# EAGLE design P_B_Jan_2018 (EAGLE 7.1.0)
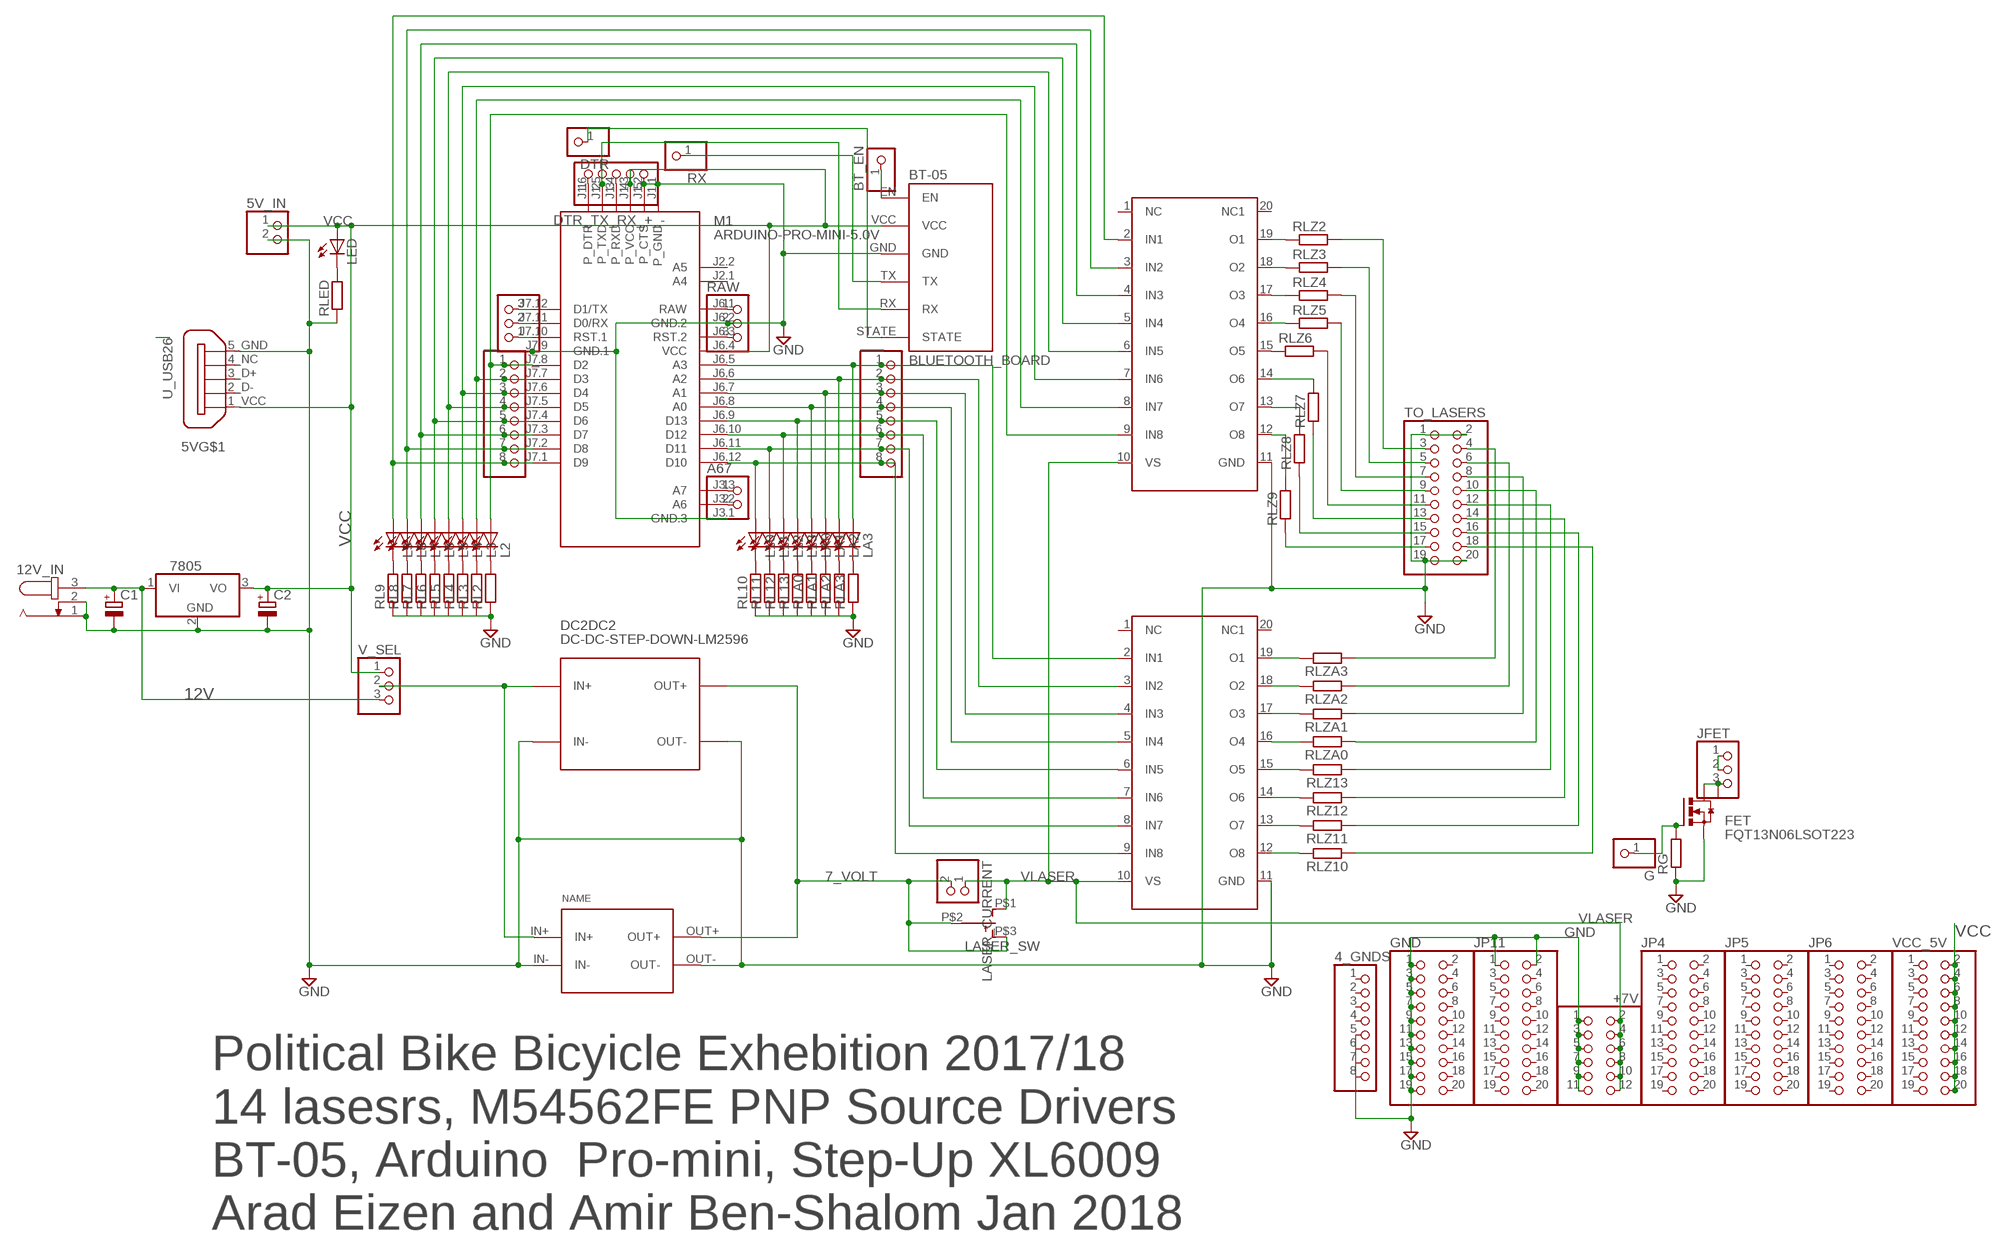
[diagram p0: schematic, sheet 1]

## Parts
4_GNDS  PINHD-1X8  [1X08]
5V  U_USB26  [U_USB_26]
5V_IN  PINHD-1X2SQ&RND  [1X02_SQ&ROUND]
12V_IN  JACK-PLUGHOLE_PAD  [JACK_DC]
7805  7805TV  [TO220V]
+7V  PINHD-2X6  [2X06]
_  PINHD-1X3  [1X03]
__  PINHD-1X8  [1X08]
___  PINHD-1X8  [1X08]
A67  PINHD-1X2ROUND_PAD  [1X02_ROUND_PAD]
BT-05  BLUETOOTH_BOARD  [BT_BOARD_FOOTPRINT]
BT_EN  PINHD-1X1  [1X01]
C1  CPOL-EUE3.5-10  [E3,5-10]
C2  CPOL-EUE2.5-6  [E2,5-6]
DC2DC  DC2DC_CP8-ADJ  [CP8-ADJ]
DC2DC2  DC-DC-STEP-DOWN-LM2596  [DC-DC-STEP-DOWN-LM2596]
DTR  PINHD-1X1  [1X01]
DTR_TX_RX_+_-  PINHD-1X5  [1X05]
FET  FQT13N06LSOT223  [SOT223]
G  PINHD-1X1  [1X01]
GND  PINHD-2X10  [2X10]
JFET  PIN_HEAD_1X3_MARKED2.56  [1X3_MARKED]
JP4  PINHD-2X10  [2X10]
JP5  PINHD-2X10  [2X10]
JP6  PINHD-2X10  [2X10]
JP11  PINHD-2X10  [2X10]
L2  LEDCHIPLED_1206  [CHIPLED_1206]
L3  LEDCHIPLED_1206  [CHIPLED_1206]
L4  LEDCHIPLED_1206  [CHIPLED_1206]
L5  LEDCHIPLED_1206  [CHIPLED_1206]
L6  LEDCHIPLED_1206  [CHIPLED_1206]
L7  LEDCHIPLED_1206  [CHIPLED_1206]
L8  LEDCHIPLED_1206  [CHIPLED_1206]
L9  LEDCHIPLED_1206  [CHIPLED_1206]
L10  LEDCHIPLED_1206  [CHIPLED_1206]
L11  LEDCHIPLED_1206  [CHIPLED_1206]
L12  LEDCHIPLED_1206  [CHIPLED_1206]
L13  LEDCHIPLED_1206  [CHIPLED_1206]
LA0  LEDCHIPLED_1206  [CHIPLED_1206]
LA1  LEDCHIPLED_1206  [CHIPLED_1206]
LA2  LEDCHIPLED_1206  [CHIPLED_1206]
LA3  LEDCHIPLED_1206  [CHIPLED_1206]
LASER_CURRENT  PINHD-1X2ROUND_PAD  [1X02_ROUND_PAD]
LASER_SW  SW_SPDTSS_12D_00_W  [SS_12D_00_W]
LED  LED3MM  [LED3MM]
M1  ARDUINO-PRO-MINI-5.0V  [ARDUINO-PRO-MINI]
RAW  PINHD-1X3  [1X03]
RG  R-EU_R0603  [R0603]
RL2  R-EU_R0603  [R0603]
RL3  R-EU_R0603  [R0603]
RL4  R-EU_R0603  [R0603]
RL5  R-EU_R0603  [R0603]
RL6  R-EU_R0603  [R0603]
RL7  R-EU_R0603  [R0603]
RL8  R-EU_R0603  [R0603]
RL9  R-EU_R0603  [R0603]
RL10  R-EU_R0603  [R0603]
RL11  R-EU_R0603  [R0603]
RL12  R-EU_R0603  [R0603]
RL13  R-EU_R0603  [R0603]
RLA0  R-EU_R0603  [R0603]
RLA1  R-EU_R0603  [R0603]
RLA2  R-EU_R0603  [R0603]
RLA3  R-EU_R0603  [R0603]
RLED  R-EU_R0603  [R0603]
RLZ2  R-EU_R0603  [R0603]
RLZ3  R-EU_R0603  [R0603]
RLZ4  R-EU_R0603  [R0603]
RLZ5  R-EU_R0603  [R0603]
RLZ6  R-EU_R0603  [R0603]
RLZ7  R-EU_R0603  [R0603]
RLZ8  R-EU_R0603  [R0603]
RLZ9  R-EU_R0603  [R0603]
RLZ10  R-EU_R0603  [R0603]
RLZ11  R-EU_R0603  [R0603]
RLZ12  R-EU_R0603  [R0603]
RLZ13  R-EU_R0603  [R0603]
RLZA0  R-EU_R0603  [R0603]
RLZA1  R-EU_R0603  [R0603]
RLZA2  R-EU_R0603  [R0603]
RLZA3  R-EU_R0603  [R0603]
RX  PINHD-1X1  [1X01]
TO_LASERS  PINHD-2X10  [2X10]
U$5  M54562P-SOP-20  [P-SOP-20]
U$6  M54562P-SOP-20  [P-SOP-20]
V_SEL  PIN_HEAD_1X3_MARKED2.56  [1X3_MARKED]
VCC_5V  PINHD-2X10  [2X10]

## Nets
7_VOLT: DC2DC2.OUT+ DC2DC.OUT+ LASER_CURRENT.2 LASER_SW.P$2(P) LASER_SW.P$3(S)
12V: 12V_IN.3 7805.1(VI) C1.+ V_SEL.3
A0: ___.4 LA0.A M1.J6.8(A0) U$6.5(IN4)
A1: ___.3 LA1.A M1.J6.7(A1) U$6.4(IN3)
A2: ___.2 LA2.A M1.J6.6(A2) U$6.3(IN2)
A3: ___.1 LA3.A M1.J6.5(A3) U$6.2(IN1)
D10: ___.8 L10.A M1.J6.12(D10) U$6.9(IN8)
D11: ___.7 L11.A M1.J6.11(D11) U$6.8(IN7)
D12: ___.6 L12.A M1.J6.10(D12) U$6.7(IN6)
D13: ___.5 L13.A M1.J6.9(D13) U$6.6(IN5)
GND: 4_GNDS.5 4_GNDS.6 4_GNDS.7 4_GNDS.8 5V.5_GND 5V_IN.2 12V_IN.1 12V_IN.2 7805.2(GND) +7V.1 +7V.3 +7V.5 +7V.7 +7V.9 +7V.11 BT-05.GND C1.- C2.- DC2DC2.IN- DC2DC2.OUT- DC2DC.IN- DC2DC.OUT- DTR_TX_RX_+_-.5 FET.3(S) GND.1 GND.3 GND.5 GND.7 GND.9 GND.11 GND.13 GND.15 GND.17 GND.19 JP11.1 JP11.2 M1.J1.1(P_GND) M1.J1.2(P_CTS) M1.J3.1(GND.3) M1.J6.2(GND.2) M1.J7.9(GND.1) RAW.2 RG.1 RL2.1 RL3.1 RL4.1 RL5.1 RL6.1 RL7.1 RL8.1 RL9.1 RL10.1 RL11.1 RL12.1 RL13.1 RLA0.1 RLA1.1 RLA2.1 RLA3.1 RLED.1 TO_LASERS.1 TO_LASERS.2 TO_LASERS.19 TO_LASERS.20 U$5.11(GND) U$6.11(GND)
N$1: RLZ2.2 TO_LASERS.3
N$2: RLZ3.2 TO_LASERS.5
N$3: RLZ4.2 TO_LASERS.7
N$4: RLZ5.2 TO_LASERS.9
N$5: RLZ6.2 TO_LASERS.11
N$6: RLZ7.1 TO_LASERS.13
N$7: RLZ8.1 TO_LASERS.15
N$8: RLZ9.1 TO_LASERS.17
N$9: RLZA3.1 TO_LASERS.4
N$10: RLZA2.1 TO_LASERS.6
N$11: __.2 L3.A M1.J7.7(D3) U$5.8(IN7)
N$12: __.3 L4.A M1.J7.6(D4) U$5.7(IN6)
N$13: __.4 L5.A M1.J7.5(D5) U$5.6(IN5)
N$14: __.5 L6.A M1.J7.4(D6) U$5.5(IN4)
N$15: __.6 L7.A M1.J7.3(D7) U$5.4(IN3)
N$16: __.7 L8.A M1.J7.2(D8) U$5.3(IN2)
N$17: __.8 L9.A M1.J7.1(D9) U$5.2(IN1)
N$18: __.1 L2.A M1.J7.8(D2) U$5.9(IN8)
N$19: RLZA1.1 TO_LASERS.8
N$20: RLZA0.1 TO_LASERS.10
N$21: RLZ13.1 TO_LASERS.12
N$22: RLZ12.1 TO_LASERS.14
N$23: RLZ11.1 TO_LASERS.16
N$24: RLZ10.1 TO_LASERS.18
N$25: RLZ3.1 U$5.18(O2)
N$26: RLZ4.1 U$5.17(O3)
N$27: BT-05.STATE DTR.1
N$28: BT-05.RX DTR_TX_RX_+_-.2 M1.J1.5(P_TXD)
N$29: BT-05.TX RX.1
N$30: RLZ2.1 U$5.19(O1)
N$31: RLZ5.1 U$5.16(O4)
N$32: RLZ6.1 U$5.15(O5)
N$33: RLZ7.2 U$5.14(O6)
N$34: RLZ8.2 U$5.13(O7)
N$35: RLZ9.2 U$5.12(O8)
N$36: RLZ10.2 U$6.12(O8)
N$37: RLZ11.2 U$6.13(O7)
N$38: RLZ12.2 U$6.14(O6)
N$39: RLZ13.2 U$6.15(O5)
N$40: RLZA0.2 U$6.16(O4)
N$41: RLZA1.2 U$6.17(O3)
N$42: RLZA2.2 U$6.18(O2)
N$43: RLZA3.2 U$6.19(O1)
N$44: L2.C RL2.2
N$45: L3.C RL3.2
N$46: L4.C RL4.2
N$47: L5.C RL5.2
N$48: L6.C RL6.2
N$49: L7.C RL7.2
N$50: L8.C RL8.2
N$51: L9.C RL9.2
N$52: LED.K(C) RLED.2
N$53: _.1 M1.J7.10(RST.1)
N$55: DC2DC2.IN+ DC2DC.IN+ V_SEL.2
N$56: _.2 M1.J7.11(D0/RX)
N$57: _.3 M1.J7.12(D1/TX)
N$58: A67.1 M1.J3.3(A7)
N$59: A67.2 M1.J3.2(A6)
N$60: LA3.C RLA3.2
N$61: LA2.C RLA2.2
N$62: LA1.C RLA1.2
N$63: LA0.C RLA0.2
N$64: L13.C RL13.2
N$65: L12.C RL12.2
N$66: L11.C RL11.2
N$67: L10.C RL10.2
N$68: M1.J6.1(RAW) RAW.1
N$69: M1.J6.3(RST.2) RAW.3
N$70: FET.1(G) G.1 RG.2
N$71: JFET.1 JFET.2
N$72: DTR_TX_RX_+_-.3 M1.J1.4(P_RXD)
N$73: DTR_TX_RX_+_-.1 M1.J1.6(P_DTR)
N$74: FET.2(D) FET.4(D1) JFET.3
N$75: BT-05.EN BT_EN.1
VCC: 5V.1_VCC(1_VDD) 5V_IN.1 7805.3(VO) BT-05.VCC C2.+ DTR_TX_RX_+_-.4 LED.A M1.J1.3(P_VCC) M1.J6.4(VCC) V_SEL.1 VCC_5V.2 VCC_5V.4 VCC_5V.6 VCC_5V.8 VCC_5V.10 VCC_5V.12 VCC_5V.14 VCC_5V.16 VCC_5V.18 VCC_5V.20
VLASER: +7V.2 +7V.4 +7V.6 +7V.8 +7V.10 +7V.12 LASER_CURRENT.1 LASER_SW.P$1(O) U$5.10(VS) U$6.10(VS)
Unconnected: 4_GNDS.1 4_GNDS.2 4_GNDS.3 4_GNDS.4 5V.2_D- 5V.3_D+ 5V.4_NC 5V.S1 5V.S2 5V.S3 5V.S4 GND.2 GND.4 GND.6 GND.8 GND.10 GND.12 GND.14 GND.16 GND.18 GND.20 JP4.1 JP4.2 JP4.3 JP4.4 JP4.5 JP4.6 JP4.7 JP4.8 JP4.9 JP4.10 JP4.11 JP4.12 JP4.13 JP4.14 JP4.15 JP4.16 JP4.17 JP4.18 JP4.19 JP4.20 JP5.1 JP5.2 JP5.3 JP5.4 JP5.5 JP5.6 JP5.7 JP5.8 JP5.9 JP5.10 JP5.11 JP5.12 JP5.13 JP5.14 JP5.15 JP5.16 JP5.17 JP5.18 JP5.19 JP5.20 JP6.1 JP6.2 JP6.3 JP6.4 JP6.5 JP6.6 JP6.7 JP6.8 JP6.9 JP6.10 JP6.11 JP6.12 JP6.13 JP6.14 JP6.15 JP6.16 JP6.17 JP6.18 JP6.19 JP6.20 JP11.3 JP11.4 JP11.5 JP11.6 JP11.7 JP11.8 JP11.9 JP11.10 JP11.11 JP11.12 JP11.13 JP11.14 JP11.15 JP11.16 JP11.17 JP11.18 JP11.19 JP11.20 M1.J2.1(A4) M1.J2.2(A5) U$5.1(NC) U$5.20(NC1) U$6.1(NC) U$6.20(NC1) VCC_5V.1 VCC_5V.3 VCC_5V.5 VCC_5V.7 VCC_5V.9 VCC_5V.11 VCC_5V.13 VCC_5V.15 VCC_5V.17 VCC_5V.19

## Notes on the sheet
- Political Bike Bicyicle Exhebition 2017/18
  14 lasesrs, M54562FE PNP Source Drivers
  BT-05, Arduino  Pro-mini, Step-Up XL6009
  Arad Eizen and Amir Ben-Shalom Jan 2018

## Library data of the parts
4_GNDS __ ___ = pinhead:PINHD-1X8: PIN HEADER
5V = Amir_May_15_for_Copy_only:U_USB
5V_IN A67 = Amir_May_15_for_Copy_only:PINHD-1X2: PIN HEADER
12V_IN = Amir_May_15_for_Copy_only:JACK-PLUG: DC POWER JACK Power Jack, DC, Right Angle, Through Hole, Rated 5A at 16VDC, PC Terminals Distributor: Farnell (www.Farnell.de) Drawing: 84N1161.pdf / 84N1162.pdf Manufacturer: SPC Technology (www.spctechnology.com) Type: SPC4077 / SPC 4078
7805 = linear:78*: Positive VOLTAGE REGULATOR Source: http://cache.national.com/ds/LM/LM78L05.pdf http://www.fairchildsemi.com/ds/LM/LM7805.pdf
+7V = pinhead:PINHD-2X6: PIN HEADER
_ RAW = pinhead:PINHD-1X3: PIN HEADER
BT-05 = Amir_Mofule_Jan_2018:BLUETOOTH_BOARD: Bluetooth Board V1.05
BT_EN DTR G RX = pinhead:PINHD-1X1: PIN HEADER
C1 C2 = Amir_May_15:CPOL-EU: POLARIZED CAPACITOR, European symbol
DC2DC = Amir_Mofule_Jan_2018:DC2DC_CP8-ADJ: Voltage regulator IN: 7-35V OUT: ADJ
DC2DC2 = Amir_Mofule_Jan_2018:DC-DC-STEP-DOWN-LM2596: DC/DC Step-Down Regulator based on LM2596-ADJ chip
DTR_TX_RX_+_- = pinhead:PINHD-1X5: PIN HEADER
FET = Amir_May_15:FQT13N06L: Power Mos Fet N
GND JP4-JP6 JP11 TO_LASERS VCC_5V = pinhead:PINHD-2X10: PIN HEADER
JFET V_SEL = Amir_May_15:PIN_HEAD_1X3_MARKED
L2-L13 LA0 LA1-LA3 LED = Amir_May_15:LED: LED OSRAM: - CHIPLED LG R971, LG N971, LY N971, LG Q971, LY Q971, LO R971, LY R971 LH N974, LH R974 LS Q976, LO Q976, LY Q976 LO Q996 - Hyper CHIPLED LW Q18S LB Q993, LB Q99A, LB R99A - SideLED LS A670, LO A670, LY A670, LG A670, LP A670 LB A673, LV A673, LT A673, LW A673 LH A674 LY A675 LS A676, LA A676, LO A676, LY A676, LW A676 LS A679, LY A679, LG A679 - Hyper Micro SIDELED® LS Y876, LA Y876, LO Y876, LY Y876 LT Y87S - SmartLED LW L88C, LW L88S LB L89C, LB L89S, LG L890 LS L89K, LO L89K, LY L89K LS L896, LA L896, LO L896, LY L896 - TOPLED LS T670, LO T670, LY T670, LG T670, LP T670 LSG T670, LSP T670, LSY T670, LOP T670, LYG T670 LG T671, LOG T671, LSG T671 LB T673, LV T673, LT T673, LW T673 LH T674 LS T676, LA T676, LO T676, LY T676, LB T676, LH T676, LSB T676, LW T676 LB T67C, LV T67C, LT T67C, LS T67K, LO T67K, LY T67K, LW E67C LS E67B, LA E67B, LO E67B, LY E67B, LB E67C, LV E67C, LT E67C LW T67C LS T679, LY T679, LG T679 LS T770, LO T770, LY T770, LG T770, LP T770 LB T773, LV T773, LT T773, LW T773 LH T774 LS E675, LA E675, LY E675, LS T675 LS T776, LA T776, LO T776, LY T776, LB T776 LHGB T686 LT T68C, LB T68C - Hyper Mini TOPLED® LB M676 - Mini TOPLED Santana® LG M470 LS M47K, LO M47K, LY M47K Source: http://www.osram.convergy.de/
LASER_CURRENT = Amir_May_15:PINHD-1X2: PIN HEADER
LASER_SW = Amir_May_15:SW_SPDT: TINY SWITCH ON OFF MOM Source: http://www2.produktinfo.conrad.com/datenblaetter/700000-724999/705152-da-01-de-Subminiaturschalter_TL_36YO.pdf
M1 = Amir_Mofule_Jan_2018:ARDUINO-PRO-MINI-*: Arduino Pro Mini
RG RL2-RL13 RLA0 RLA1-RLA3 RLED RLZ2-RLZ13 RLZA0 RLZA1-RLZA3 = Amir_May_15:R-EU_: RESISTOR, European symbol
U$5 U$6 = Amir_May_15:M54562

## Board
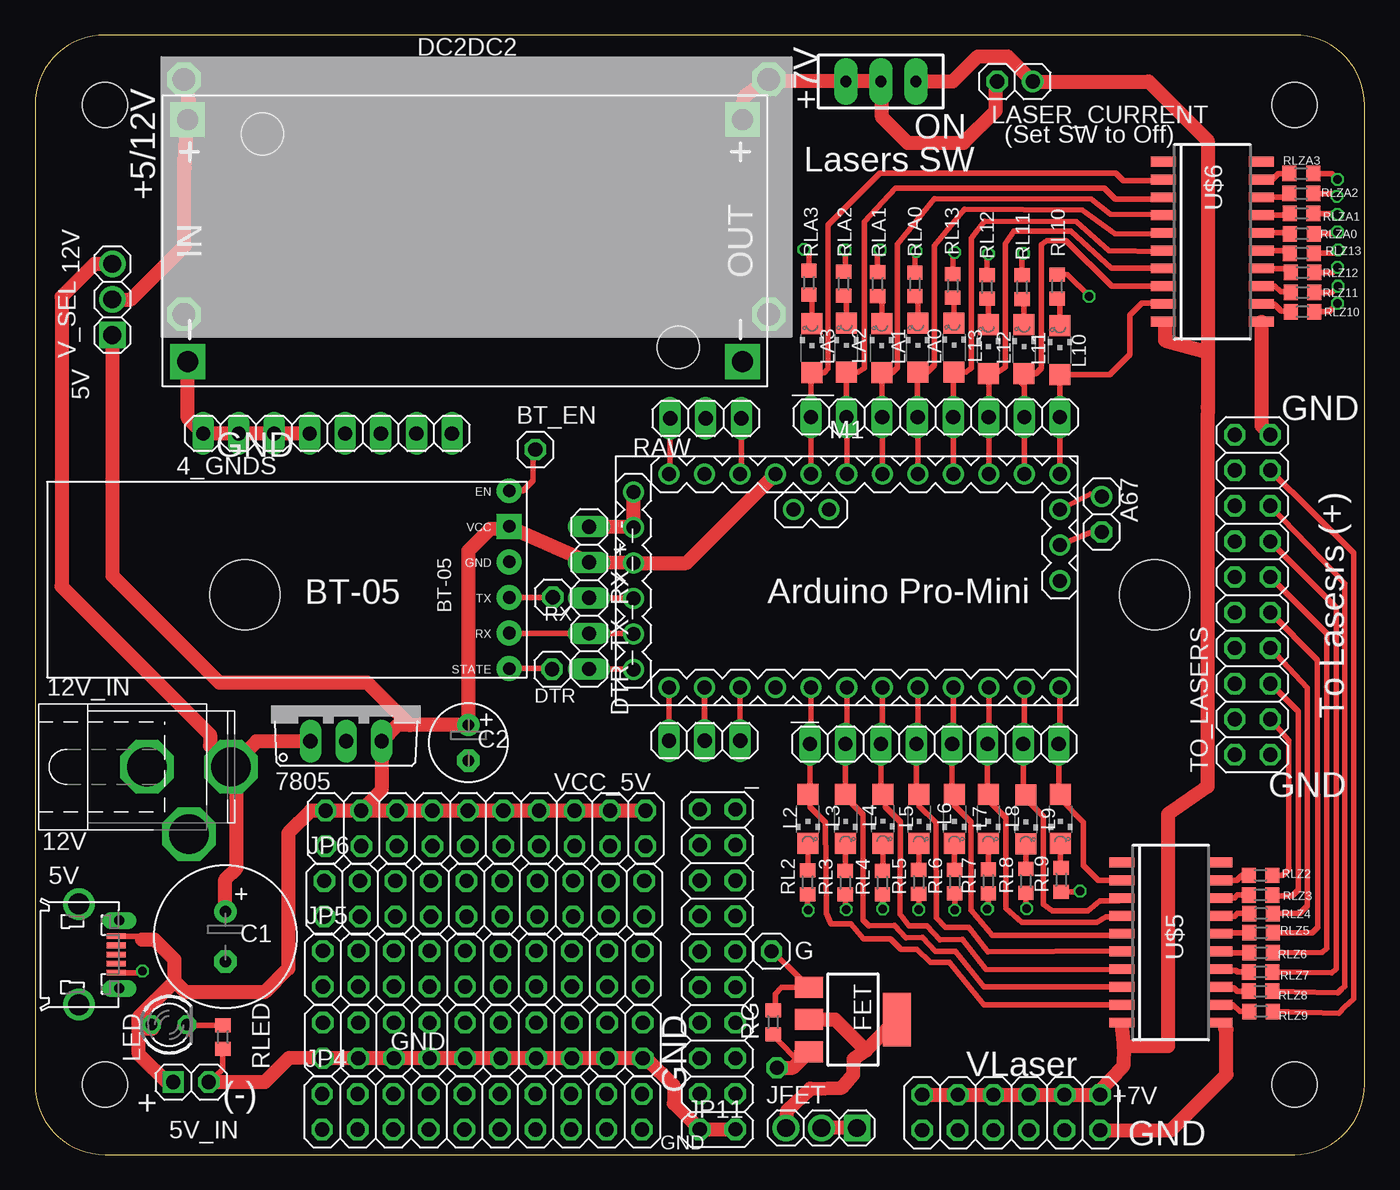
[diagram p1: board, top side]
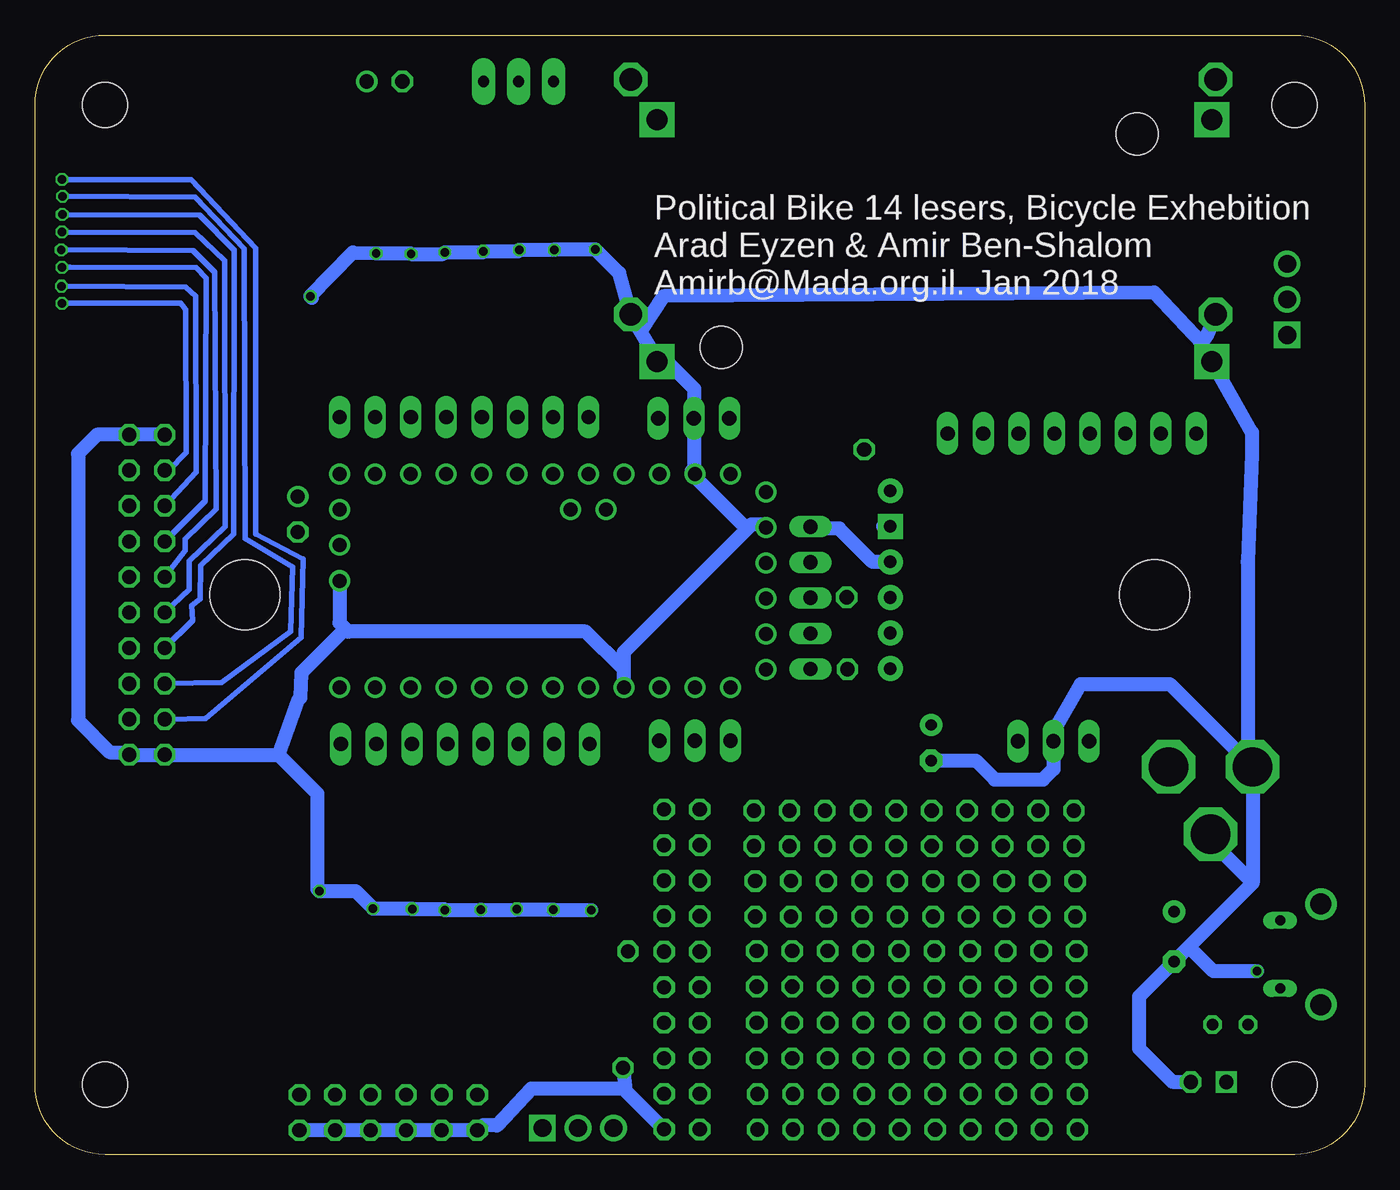
[diagram p2: board, bottom side, seen from below]

Size 95 x 80 mm. Coordinates in mm from the lower left corner, seen from the top.
Outline: 0,75 0,5 arc90 5,0 90,0 arc90 95,5 95,75 arc90 90,80 5,80 arc90 0,75
Copper layers (1*16): Top 0.035mm / dielectric 1.5mm / Bottom 0.035mm
Design rules "NOA Eagle Rule 2016-06-12": minimum track width 6mil, minimum drill 0.3mm, track to track 6mil, track to pad 6mil, pad to pad 6mil, via to via 6mil, smd to smd 0mil, copper to edge 0.4mm, drill to drill 10mil, minimum pad ring 10mil, minimum via ring 6mil, stop-mask expansion 2mil, vias tented up to drill 25mil, thermal gap 10mil
Holes 3.2 mm at 5,5 90,5 5,75 90,75
Holes 5 mm at 80,40 15,40

### Footprints (pad centres in the part's own frame; a part is rotated, then mirrored left to right if it is on the bottom)
1X08 = drill 1.016 long: 1 -8.89,0; 2 -6.35,0; 3 -3.81,0; 4 -1.27,0; 5 1.27,0; 6 3.81,0; 7 6.35,0; 8 8.89,0
U_USB_26 = smd 1.35 x 0.4: 1_VCC 4.825,1.3; 2_D- 4.825,0.65; 3_D+ 4.825,0; 4_NC 4.825,-0.65; 5_GND 4.825,-1.3 | drill 1.5: S1 2.15,-3.6; S2 2.15,3.6 | drill 0.7 long: S3 5.05,2.425; S4 5.05,-2.425
1X02_SQ&ROUND = drill 1.016 square: 1 -1.27,0 | drill 1.016 octagon: 2 1.27,0
JACK_DC = drill 2.8 octagon: 1 -3,0; 2 0,-4.8; 3 3,0
TO220V = drill 1.016 long: 1 -2.54,-2.54; 2 0,-2.54; 3 2.54,-2.54
2X06 = drill 1.016 octagon: 1 -6.35,-1.27; 2 -6.35,1.27; 3 -3.81,-1.27; 4 -3.81,1.27; 5 -1.27,-1.27; 6 -1.27,1.27; 7 1.27,-1.27; 8 1.27,1.27; 9 3.81,-1.27; 10 3.81,1.27; 11 6.35,-1.27; 12 6.35,1.27
1X03 = drill 1.016 long: 1 -2.54,0; 2 0,0; 3 2.54,0
1X02_ROUND_PAD = drill 1.016: 1 -1.27,0 | drill 1.016 octagon: 2 1.27,0
BT_BOARD_FOOTPRINT = drill 0.9 pad 1.778: EN -16.51,-6.35; GND -16.51,-1.27; RX -16.51,3.81; STATE -16.51,6.35; TX -16.51,1.27 | drill 0.9 pad 1.778 square: VCC -16.51,-3.81
1X01 = drill 1.016 octagon: 1 0,0
E3,5-10 = drill 0.813 pad 1.6: + -1.778,0 | drill 0.813 pad 1.6 octagon: - 1.778,0
E2,5-6 = drill 0.813 pad 1.6: + -1.27,0 | drill 0.813 pad 1.6 octagon: - 1.27,0
CP8-ADJ = drill 1.6 octagon: IN+ -21.81,7.05; IN- -21.81,-9.75; OUT+ 19.99,7.05; OUT- 19.99,-9.75
DC-DC-STEP-DOWN-LM2596 = drill 1.5 pad 2.5 square: IN+ -19.812,8.636; IN- -19.812,-8.636; OUT+ 19.812,8.636; OUT- 19.812,-8.636 | hole 3: -14.478,7.62; 15.24,-7.62
1X05 = drill 1.016 long: 1 -5.08,0; 2 -2.54,0; 3 0,0; 4 2.54,0; 5 5.08,0
SOT223 = smd 1.5 x 2: 1 -2.3,-3.15; 2 0,-3.15; 3 2.3,-3.15 | smd 3.8 x 2: 4 0,3.15
2X10 = drill 1.016 octagon: 1 -11.43,-1.27; 2 -11.43,1.27; 3 -8.89,-1.27; 4 -8.89,1.27; 5 -6.35,-1.27; 6 -6.35,1.27; 7 -3.81,-1.27; 8 -3.81,1.27; 9 -1.27,-1.27; 10 -1.27,1.27; 11 1.27,-1.27; 12 1.27,1.27; 13 3.81,-1.27; 14 3.81,1.27; 15 6.35,-1.27; 16 6.35,1.27; 17 8.89,-1.27; 18 8.89,1.27; 19 11.43,-1.27; 20 11.43,1.27
1X3_MARKED = drill 1.27 square: 1 -2.54,0 | drill 1.27: 2 0,0; 3 2.54,0
CHIPLED_1206 = smd 1.5 x 1.5: A 0,-1.75; C 0,1.75
SS_12D_00_W = drill 0.8 pad 1.676 long: P$1 1.31,1.27; P$2 3.81,1.27; P$3 6.31,1.27
LED3MM = drill 0.813 octagon: A -1.27,0; K 1.27,0
ARDUINO-PRO-MINI = drill 1: J1.1 -15.24,6.35; J1.2 -15.24,3.81; J1.3 -15.24,1.27; J1.4 -15.24,-1.27; J1.5 -15.24,-3.81; J1.6 -15.24,-6.35; J2.1 -1.27,5.08; J2.2 -3.81,5.08; J3.1 15.24,0; J3.2 15.24,2.54; J3.3 15.24,5.08; J6.1 -12.7,7.62; J6.2 -10.16,7.62; J6.3 -7.62,7.62; J6.4 -5.08,7.62; J6.5 -2.54,7.62; J6.6 0,7.62; J6.7 2.54,7.62; J6.8 5.08,7.62; J6.9 7.62,7.62; J6.10 10.16,7.62; J6.11 12.7,7.62; J6.12 15.24,7.62; J7.1 15.24,-7.62; J7.2 12.7,-7.62; J7.3 10.16,-7.62; J7.4 7.62,-7.62; J7.5 5.08,-7.62; J7.6 2.54,-7.62; J7.7 0,-7.62; J7.8 -2.54,-7.62; J7.9 -5.08,-7.62; J7.10 -7.62,-7.62; J7.11 -10.16,-7.62; J7.12 -12.7,-7.62
R0603 = smd 1 x 1.1: 1 -0.85,0; 2 0.85,0
P-SOP-20 = smd 0.7 x 1.8: 1 -5.715,-3.5; 2 -4.445,-3.5; 3 -3.175,-3.5; 4 -1.905,-3.5; 5 -0.635,-3.5; 6 0.635,-3.5; 7 1.905,-3.5; 8 3.175,-3.5; 9 4.445,-3.5; 10 5.715,-3.5; 11 5.715,3.5; 12 4.445,3.5; 13 3.175,3.5; 14 1.905,3.5; 15 0.635,3.5; 16 -0.635,3.5; 17 -1.905,3.5; 18 -3.175,3.5; 19 -4.445,3.5; 20 -5.715,3.5

### Placement (x,y rotation side)
4_GNDS  20.9,51.52 180 top
5V  0.97,14.3 0 top
5V_IN  11.15,5.17 0 top
12V_IN  11,27.7 0 top
7805  22.23,32.08 0 top
+7V  69.75,3 0 top
_  47.85,29.57 180 top
__  64.26,29.33 0 top
___  64.34,52.7 0 top
A67  76.22,45.75 270 top
BT-05  17.38,41.08 180 top
BT_EN  35.75,50.38 0 top
C1  13.6,15.57 270 top
C2  30.98,29.43 270 top
DC2DC  32.45,69.78 0 top
DC2DC2  30.73,65.3 0 top
DTR  36.95,34.67 0 top
DTR_TX_RX_+_-  39.59,39.78 90 top
FET  58.45,9.65 270 top
G  52.62,14.53 0 top
GND  32,8.15 0 top
JFET  56.2,1.9 180 top
JP4  31.95,3.05 0 top
JP5  32,13.28 0 top
JP6  32.1,18.27 0 top
JP11  48.77,13.22 90 top
L2  55.23,23.98 180 top
L3  57.92,23.98 180 top
L4  60.58,24 180 top
L5  63.17,23.98 180 top
L6  65.7,23.98 180 top
L7  68.12,23.98 180 top
L8  70.8,23.95 180 top
L9  73.28,23.98 180 top
L10  73.22,57.5 0 top
L11  70.67,57.55 0 top
L12  68.12,57.55 0 top
L13  65.67,57.67 0 top
LA0  63.08,57.65 0 top
LA1  60.5,57.62 0 top
LA2  57.98,57.65 0 top
LA3  55.52,57.62 0 top
LASER_CURRENT  70.03,76.67 180 top
LASER_SW  64.25,77.95 180 top
LED  9.6,9.28 0 top
M1  58,41 0 top
RAW  47.92,52.6 0 top
RG  52.75,9.45 90 top
RL2  55.2,19.45 90 top
RL3  57.9,19.43 90 top
RL4  60.55,19.43 90 top
RL5  63.15,19.48 90 top
RL6  65.72,19.5 90 top
RL7  68.12,19.52 90 top
RL8  70.8,19.55 90 top
RL9  73.33,19.62 90 top
RL10  73.03,62.02 270 top
RL11  70.53,61.98 270 top
RL12  68.03,62 270 top
RL13  65.58,62.08 270 top
RLA0  62.88,62.17 270 top
RLA1  60.2,62.2 270 top
RLA2  57.77,62.23 270 top
RLA3  55.3,62.3 270 top
RLED  13.43,8.4 90 top
RLZ2  87.58,19.95 0 top
RLZ3  87.58,18.55 0 top
RLZ4  87.6,17.23 0 top
RLZ5  87.6,15.85 0 top
RLZ6  87.6,14.43 0 top
RLZ7  87.58,13.05 180 top
RLZ8  87.58,11.68 180 top
RLZ9  87.6,10.22 180 top
RLZ10  90.58,60.23 180 top
RLZ11  90.58,61.6 180 top
RLZ12  90.58,63.02 180 top
RLZ13  90.53,64.4 180 top
RLZA0  90.53,65.8 180 top
RLZA1  90.5,67.25 180 top
RLZA2  90.47,68.67 180 top
RLZA3  90.47,70.1 180 top
RX  37,39.83 0 top
TO_LASERS  87,40 90 top
U$5  81.15,15.15 270 top
U$6  84.12,65.22 270 top
V_SEL  5.53,61.1 90 top
VCC_5V  32.2,23.3 0 top

### Tracks (layer width: path | path; a pad name or v marks a point on that pad's centre or on a via)
7_VOLT
  Top 1.016: DC2DC2.OUT+ 50.66,75.57 DC2DC.OUT+ 52.44,76.68 LASER_SW.P$3 LASER_SW.P$2 60.52,76.59 60.52,74.12 62.35,72.3 66.35,72.3 68.65,74.6 68.65,76.57 LASER_CURRENT.2
12V
  Top 1.016: 7805.1 15.84,29.54 12V_IN.3 | C1.+ 13.6,19.65 14.4,20.45 14.4,27.3 12V_IN.3 | V_SEL.3 4.24,63.64 1.9,61.3 1.9,40.6 12.5,30 12.5,29.2 12V_IN.3
A0
  Top 0.406: M1.J6.8 ___.4 LA0.A 63.77,55.9 64.28,56.4 64.28,64.95 66.4,67.55 74.85,67.5 77.15,65.8 80.54,65.78 U$6.5
A1
  Top 0.406: M1.J6.7 60.54,51.99 60.6,52.05 60.6,52.63 ___.3 60.53,55.84 LA1.A 61.25,55.88 61.62,56.25 61.62,65.05 64.28,68.3 75.47,68.28 76.85,67.2 79.92,67.15 80.12,66.95 80.44,66.95 U$6.4
A2
  Top 0.406: M1.J6.6 ___.2 57.99,55.88 LA2.A 58.8,55.9 59.27,56.2 59.27,66.67 61.48,69.05 76.42,69.05 77.2,68.28 80.5,68.28 U$6.3
A3
  Top 0.406: M1.J6.5 ___.1 55.45,55.8 LA3.A 56.4,55.88 56.67,56.15 56.67,66.42 60.38,70.12 77.22,70.12 77.75,69.6 80.56,69.6 U$6.2
D10
  Top 0.406: M1.J6.12 73.24,51.94 73,52.17 73,52.47 ___.8 L10.A 76.8,55.75 78.22,57.17 78.22,60 79.08,60.85 80.56,60.85 U$6.9
D11
  Top 0.406: M1.J6.11 ___.7 70.69,54.96 70.1,55.55 70.42,55.55 L11.A 71.5,55.8 71.9,56.2 71.9,65.03 72.3,65.3 73.67,65.3 76.95,62.05 U$6.8
D12
  Top 0.406: M1.J6.10 ___.6 68.15,55.77 L12.A 68.67,55.8 69.35,56.27 69.35,65.08 69.95,66 74.03,65.97 76.9,63.33 80.57,63.35 U$6.7
D13
  Top 0.406: M1.J6.9 ___.5 65.61,55.86 L13.A 66.5,55.92 66.92,56.2 66.92,65.5 67.83,66.7 74.42,66.67 76.72,64.58 80.71,64.53 U$6.6
GND  (via drill 0.6, 1)
  Top 0.406: RL3.1 57.9,17.57 v57.98,17.5 | v60.58,17.55 60.58,18.55 RL4.1 | RL5.1 v63.15,17.5 | RL6.1 v65.72,17.48 | RL7.1 68.12,17.62 v68.05,17.55 | RL8.1 70.8,17.62 v70.85,17.57 | RL9.1 74.62,18.77 v74.67,18.82 | RLA3.1 55.3,64.33 v54.95,64.67 | v57.9,64.65 57.9,63.2 RLA2.1 | RLA1.1 60.2,64.45 v60.4,64.65 | RLA0.1 62.88,64.45 v62.98,64.55 | RL13.1 65.58,64.33 v65.72,64.47 | RL12.1 68.03,64.25 v68.12,64.35 | RL11.1 70.53,64.3 v70.62,64.4 | RL10.1 73.78,62.88 v75.33,61.33 | RL2.1 55.2,17.5 v55.25,17.45 | 5V.5_GND 7.58,13 v7.67,13.1 | RLED.1 13.43,6.08 5V_IN.2 | 54.42,7.35 FET.3 | RG.1 53,8.22 54.59,6.64
  Top 0.61: U$5.11 85,9.09 85.05,9
  Top 1.016: U$6.11 87.62,52.08 TO_LASERS.19 | DTR_TX_RX_+_-.5 42.71,44.86 M1.J1.2 M1.J1.1 | +7V.11 81.16,1.73 85.12,5.7 85.12,8.93 85.05,9 | v53,6.2 54.15,6.2 54.59,6.64 FET.3 | JP11.1 JP11.2 45.65,3.65 45.65,4.9 43.67,6.88 GND.19 GND.17 GND.15 GND.13 GND.11 GND.9 GND.7 GND.5 GND.3 GND.1 18.14,6.91 16.41,5.17 5V_IN.2 12.54,5.05 | 4_GNDS.5 4_GNDS.6 4_GNDS.7 4_GNDS.8 10.91,52.62 DC2DC2.IN-
  Bottom 0.406: 60.52,17.5 v60.58,17.55 60.62,17.5 | 63.17,17.48 v63.15,17.5 | 65.8,17.55 v65.72,17.48 | 68.08,17.57 v68.05,17.55 | 74.83,18.98 v74.67,18.82 | 57.88,64.67 v57.9,64.65 | 60.5,64.55 v60.4,64.65 | 63.05,64.47 v62.98,64.55 | 65.85,64.35 v65.72,64.47 | 68.17,64.4 v68.12,64.35 | 57.92,17.45 v57.98,17.5
  Bottom 1.016: v57.98,17.5 60.52,17.5 | v63.15,17.5 60.62,17.5 | v65.72,17.48 63.17,17.48 | v68.05,17.55 65.8,17.55 | 68.08,17.57 v70.85,17.57 72.1,18.82 v74.67,18.82 | 77.59,28.57 TO_LASERS.2 TO_LASERS.1 88.45,28.75 89.65,28.75 91.92,31.02 91.92,50.08 90.57,51.43 TO_LASERS.20 TO_LASERS.19 | 77.59,28.57 74.83,25.8 74.83,18.98 | 57.88,64.67 v54.95,64.67 53.27,62.99 DC2DC.OUT- 51.73,58.84 | v60.4,64.65 v57.9,64.65 | v62.98,64.55 60.5,64.55 | v65.72,64.47 63.05,64.47 | v68.12,64.35 65.85,64.35 | 68.17,64.4 v70.62,64.4 72.3,64.45 v75.33,61.33 75.2,61.2 | BT-05.GND 35.15,42.34 37.55,44.75 38.26,44.75 DTR_TX_RX_+_-.5 | 44.12,44.7 52.92,35.91 M1.J7.9 52.92,34.65 55.65,37.38 72.61,37.38 73.24,38 | 44.12,44.7 43.77,45.05 43,45.05 M1.J1.2 | M1.J6.2 47.84,48.41 44.12,44.7 | 48.08,48.85 M1.J6.2 | 77.59,28.57 76.15,32.55 76.05,32.65 75.97,34.42 72.86,37.53 73.24,38 | M1.J3.1 73.24,38 | v55.25,17.45 57.92,17.45 | 51.73,58.84 50.81,57.27 DC2DC2.OUT- 49.84,56.66 47.9,54.73 47.9,52.62 RAW.2 47.92,48.7 M1.J6.2 | 11.64,58 DC2DC2.IN- 8.05,51.6 8.05,50 8.35,42.38 8.35,27.32 8,26.98 | 11.64,58 11.16,58.7 DC2DC.IN- | 51.73,58.84 50.1,61.33 15.03,61.6 11.64,58 | 8,26.98 12V_IN.1 13.93,33.62 20.27,33.62 22.23,30.2 7805.2 22.23,27.55 22.98,26.8 26.43,26.8 27.78,28.16 C2.- | 8,26.98 8,19.4 | 8,19.4 12.55,14.85 | 12.55,14.85 C1.- 16.12,11.27 16.12,7.58 13.75,5.2 12.45,5.2 5V_IN.2 | v7.67,13.1 10.8,13.1 12.55,14.85 | 12V_IN.2 11,22.4 8,19.4 | v53,6.2 52.8,4.55 | JP11.1 52.8,4.55 | 52.8,4.55 52.95,4.72 59.52,4.72 61.99,2.08 63.05,2.08 +7V.1 +7V.3 +7V.5 +7V.7 +7V.9 +7V.11
N$1
  Top 0.406: TO_LASERS.3 89.58,29.58 89.58,20.38 89.15,19.95 RLZ2.2
N$2
  Top 0.406: TO_LASERS.5 90.25,31.64 90.25,18.93 89.83,18.5 88.47,18.5 RLZ3.2
N$3
  Top 0.406: TO_LASERS.7 90.92,33.34 90.92,17.77 90.38,17.23 RLZ4.2
N$4
  Top 0.406: TO_LASERS.9 91.62,35.35 91.65,16.25 91.25,15.85 RLZ5.2
N$5
  Top 0.406: TO_LASERS.11 92.3,37.24 92.3,14.72 91.99,14.44 91.95,14.45 RLZ6.2
N$6
  Top 0.406: TO_LASERS.13 92.97,39.1 92.97,13.28 92.67,12.97 RLZ7.1
N$7
  Top 0.406: TO_LASERS.15 93.6,40.82 93.6,12.03 93.38,11.82 93.1,11.55 RLZ8.1
N$8
  Top 0.406: TO_LASERS.17 94.22,42.98 94.22,11.12 93.61,10.55 93.15,10.1 RLZ9.1
N$9  (via drill 0.6)
  Top 0.406: RLZA3.1 92.65,70.1 v93.08,69.67
  Bottom 0.406: v93.08,69.67 83.83,69.67 79.22,64.78 79.25,44.35 75.85,42.55 76,36.95 82.8,31.15 85.47,31.1 TO_LASERS.4
N$10  (via drill 0.6)
  Top 0.406: 93,68.45 v93.03,68.47 92.83,68.67 RLZA2.1
  Bottom 0.406: v93.03,68.47 83.55,68.42 80.05,64.75 79.97,44.02 76.58,42 76.72,37.38 81.65,33.73 85.7,33.67 TO_LASERS.6
N$11
  Top 0.406: U$5.8 77.62,12 67.8,12 65.75,14.53 64.35,14.53 63.42,15.53 62.23,15.5 61.42,16.38 59.58,16.35 59.17,16.77 59.17,24.3 57.92,25.55 L3.A __.2 58,29.42 M1.J7.7
N$12
  Top 0.406: U$5.7 77.61,13.2 67.95,13.25 66.28,15.38 64.67,15.35 63.73,16.32 62.45,16.35 61.8,17.2 61.83,23.77 60.77,24.82 60.77,25.55 L4.A 60.45,25.88 __.3 60.54,29.42 M1.J7.6
N$13
  Top 0.406: U$5.6 77.61,14.55 68.1,14.5 66.72,16.25 65.05,16.25 64.42,16.93 64.38,23.73 63.17,24.93 L5.A 62.99,25.91 __.4 63.08,29.42 M1.J7.5
N$14
  Top 0.406: U$5.5 77.47,15.65 68.4,15.65 66.88,17.48 66.88,23.77 65.7,24.95 L6.A 65.53,25.89 __.5 65.9,29.7 65.92,29.7 65.62,30 M1.J7.4
N$15
  Top 0.406: U$5.4 77.57,16.98 76.53,16.98 75.88,16.6 70.53,16.6 69.38,17.57 69.38,24.05 68.12,25.3 L7.A 68.07,25.78 __.6 68.16,29.42 M1.J7.3
N$16
  Top 0.406: U$5.3 77.45,18.12 76.08,18.12 75.22,17.4 72.7,17.4 72.05,17.88 72.05,24.18 70.8,25.43 L8.A 70.61,25.89 __.7 70.7,29.42 M1.J7.2
N$17
  Top 0.406: U$5.2 75.97,19.6 74.92,20.65 74.92,23.75 73.28,25.4 L9.A 73.15,25.85 __.8 73.24,29.42 M1.J7.1
N$18
  Top 0.406: 55.37,25.87 __.1 55.46,29.42 M1.J7.8 | 55.37,25.87 L2.A | 55.37,25.87 55.37,24.83 56.48,23.73 56.55,17.25 56.88,16.48 58.3,16.48 59.2,15.43 61.12,15.43 61.88,14.68 63.02,14.68 63.98,13.72 65.35,13.72 67.8,10.7 U$5.9
N$19  (via drill 0.6)
  Top 0.406: v93.05,67.18 v93.05,67.17 92.97,67.25 RLZA1.1
  Bottom 0.406: v93.05,67.17 83.25,67.12 80.78,64.62 80.8,44.33 83.17,42.1 83.2,39.7 83.8,39.23 83.75,38.17 TO_LASERS.8
N$20  (via drill 0.6)
  Top 0.406: 93.06,65.91 v93.08,65.92 92.95,65.8 RLZA0.1
  Bottom 0.406: v93.08,65.92 83.55,65.88 81.45,63.88 81.42,44.88 83.97,42.42 84,40.36 TO_LASERS.10
N$21  (via drill 0.6)
  Top 0.406: v93.11,64.64 v93.12,64.65 92.88,64.4 RLZ13.1
  Bottom 0.406: v93.12,64.65 83.7,64.6 82.15,63.05 82.05,46.12 84.28,43.98 84.28,43.15 TO_LASERS.12
N$22  (via drill 0.6)
  Top 0.406: 93.05,63.37 v93.08,63.4 92.7,63.02 RLZ12.1
  Bottom 0.406: v93.08,63.4 92.53,63.4 83.5,63.38 82.78,62.62 82.85,46.69 TO_LASERS.14
N$23  (via drill 0.6)
  Top 0.406: RLZ11.1 92.65,61.6 v93.1,62.05
  Bottom 0.406: v93.1,62.05 92.92,62.05 84.25,61.98 83.53,61.35 83.5,48.78 TO_LASERS.16
N$24  (via drill 0.6)
  Top 0.406: RLZ10.1 92.47,60.23 v93.08,60.83
  Bottom 0.406: v93.08,60.83 84.58,60.83 84.25,60.38 84.2,50.15 85.46,48.89 TO_LASERS.18
N$25
  Top 0.406: RLZ3.1 85.92,18.55 85.72,18.35 84.67,18.35 U$5.18
N$26
  Top 0.406: RLZ4.1 85.92,17.23 85.72,17.02 84.68,17.02 U$5.17
N$27
  Top 0.406: BT-05.STATE 36.95,34.73 DTR.1
N$28
  Top 0.406: M1.J1.5 42.76,37.24 DTR_TX_RX_+_-.2 33.88,37.24 BT-05.RX
N$29
  Top 0.406: BT-05.TX 37,39.8 RX.1
N$30
  Top 0.406: RLZ2.1 86.22,19.95 85.88,19.6 U$5.19
N$31
  Top 0.406: RLZ5.1 84.72,15.85 U$5.16
N$32
  Top 0.406: RLZ6.1 84.74,14.43 U$5.15
N$33
  Top 0.406: RLZ7.2 85.9,13.05 85.8,13.15 84.75,13.15 U$5.14
N$34
  Top 0.406: RLZ8.2 85.9,11.68 85.67,11.9 84.72,11.9 U$5.13
N$35
  Top 0.406: RLZ9.2 86.08,10.22 85.6,10.7 U$5.12
N$36
  Top 0.406: U$6.12 88.55,60.78 89.05,60.27 89.67,60.27 RLZ10.2
N$37
  Top 0.406: U$6.13 88.6,62.05 89,61.65 89.67,61.65 RLZ11.2
N$38
  Top 0.406: U$6.14 89.43,63.32 RLZ12.2
N$39
  Top 0.406: U$6.15 89.48,64.59 RLZ13.2
N$40
  Top 0.406: U$6.16 89.61,65.86 RLZA0.2
N$41
  Top 0.406: U$6.17 89.53,67.13 RLZA1.2
N$42
  Top 0.406: U$6.18 89.35,68.4 RLZA2.2
N$43
  Top 0.406: U$6.19 88.39,69.67 88.83,70.1 RLZA3.2
N$44
  Top 0.406: L2.C 55.23,20.32 RL2.2
N$45
  Top 0.406: L3.C 57.92,20.3 RL3.2
N$46
  Top 0.406: L4.C 60.58,20.3 RL4.2
N$47
  Top 0.406: L5.C 63.17,20.35 RL5.2
N$48
  Top 0.406: L6.C 65.7,20.38 RL6.2
N$49
  Top 0.406: L7.C RL7.2
N$50
  Top 0.406: L8.C RL8.2
N$51
  Top 0.406: L9.C 73.28,20.52 RL9.2
N$52
  Top 0.406: 10.97,8.63 LED.K 11.32,9.25 RLED.2
N$53
  Top 0.406: M1.J7.10 _.1
N$55
  Top 1.016: V_SEL.2 6.85,61.1 10.68,64.92 10.68,70.5 DC2DC2.IN+ 10.94,75.51 DC2DC.IN+
N$56
  Top 0.406: M1.J7.11 _.2
N$57
  Top 0.406: M1.J7.12 _.3
N$58
  Top 0.406: M1.J3.3 75.42,47.18 A67.1
N$59
  Top 0.406: M1.J3.2 75.58,44.52 A67.2
N$60
  Top 0.406: LA3.C 55.52,61.23 RLA3.2
N$61
  Top 0.406: LA2.C 57.98,61.17 RLA2.2
N$62
  Top 0.406: LA1.C 60.5,61.05 RLA1.2
N$63
  Top 0.406: LA0.C 63.08,61.12 RLA0.2
N$64
  Top 0.406: L13.C 65.67,61.12 RL13.2
N$65
  Top 0.406: L12.C 68.12,61.05 RL12.2
N$66
  Top 0.406: L11.C 70.67,60.98 RL11.2
N$67
  Top 0.406: L10.C 73.22,60.98 RL10.2
N$68
  Top 0.406: M1.J6.1 45.38,48.62 RAW.1
N$69
  Top 0.406: M1.J6.3 50.47,48.62 RAW.3
N$70
  Top 0.406: G.1 53.75,13.5 FET.1 53.35,11.95 52.9,11.5 52.9,10.57 RG.2
N$71
  Top 1.016: JFET.1 JFET.2
N$72
  Top 0.406: DTR_TX_RX_+_-.3 42.76,39.78 M1.J1.4
N$73
  Top 0.406: DTR_TX_RX_+_-.1 42.76,34.7 M1.J1.6
N$74
  Top 1.016: JFET.3 53.76,3.16 55.4,4.7 57.65,4.78 58.48,5.72 58.5,6.83 59.39,7.44 | 59.39,7.44 FET.4 | FET.2 57.17,9.65 59.39,7.44
N$75
  Top 0.406: BT-05.EN 34.83,47.42 35.58,48.17 35.58,50.2 BT_EN.1
VCC
  Top 0.406: 7.62,15.38 7.47,15.6 5V.1_VCC
  Top 1.016: 34.33,44.63 DTR_TX_RX_+_-.4 M1.J1.3 46.57,42.27 M1.J6.4 | 34.33,44.63 BT-05.VCC | VCC_5V.20 VCC_5V.18 VCC_5V.16 VCC_5V.14 VCC_5V.12 VCC_5V.10 VCC_5V.8 VCC_5V.6 VCC_5V.4 | VCC_5V.4 VCC_5V.2 19.7,24.57 18.1,22.98 18.1,13.3 16.4,11.6 10.75,11.6 9.97,12.38 | 26.77,30.7 C2.+ 30.98,43.15 32.55,44.73 34.24,44.73 34.33,44.63 | 26.77,30.7 25.93,30.7 7805.3 24.77,26.02 VCC_5V.4 | 5V_IN.1 9.57,5.03 7.42,7.17 7.42,8.75 | 7.42,8.75 7.42,9.82 9.97,12.38 | LED.A 8.36,9.17 8.38,9 7.67,9 7.42,8.75 | 9.97,12.38 9.97,13.93 8.55,15.35 7.65,15.35 7.62,15.38 | V_SEL.1 5.53,41.38 13.18,33.73 23.75,33.73 26.77,30.7
  Bottom 1.016: BT-05.VCC 34.38,44.88
VLASER
  Top 0.61: U$5.10 77.67,9 | 80.75,59.08 80.72,59.51 U$6.10
  Top 1.016: LASER_SW.P$1 65.58,76.68 67.38,78.47 69.5,78.47 LASER_CURRENT.1 79.58,76.67 83.8,72.45 83.8,57.35 | 83.8,57.35 83.8,53.4 83.78,52.52 83.78,26.3 80.95,24.32 80.95,7.75 77.79,7.69 | 83.8,57.35 80.75,58.17 80.75,59.08 | 77.67,9 77.79,7.69 | 77.79,7.69 77.76,6.31 76.1,4.54 +7V.12 +7V.10 +7V.8 +7V.6 +7V.4 +7V.2

### Text on the board
tNames: +5/12V | +7V | עוף | ON | (Set SW to Off) | Lasers SW | 12V | 5V | GND | GND | BT-05 | Arduino Pro-Mini | To Lasesrs (+) | GND | 12V | VLaser | + | (-) | GND | GND | GND
bNames: Political Bike 14 lesers, Bicycle Exhebition / Arad Eyzen & Amir Ben-Shalom / Amirb@Mada.org.il. Jan 2018